# EAGLE design 7segement4digits1badidea-feathershield-ht16k33-mk-1.0 (EAGLE 7.5.0)
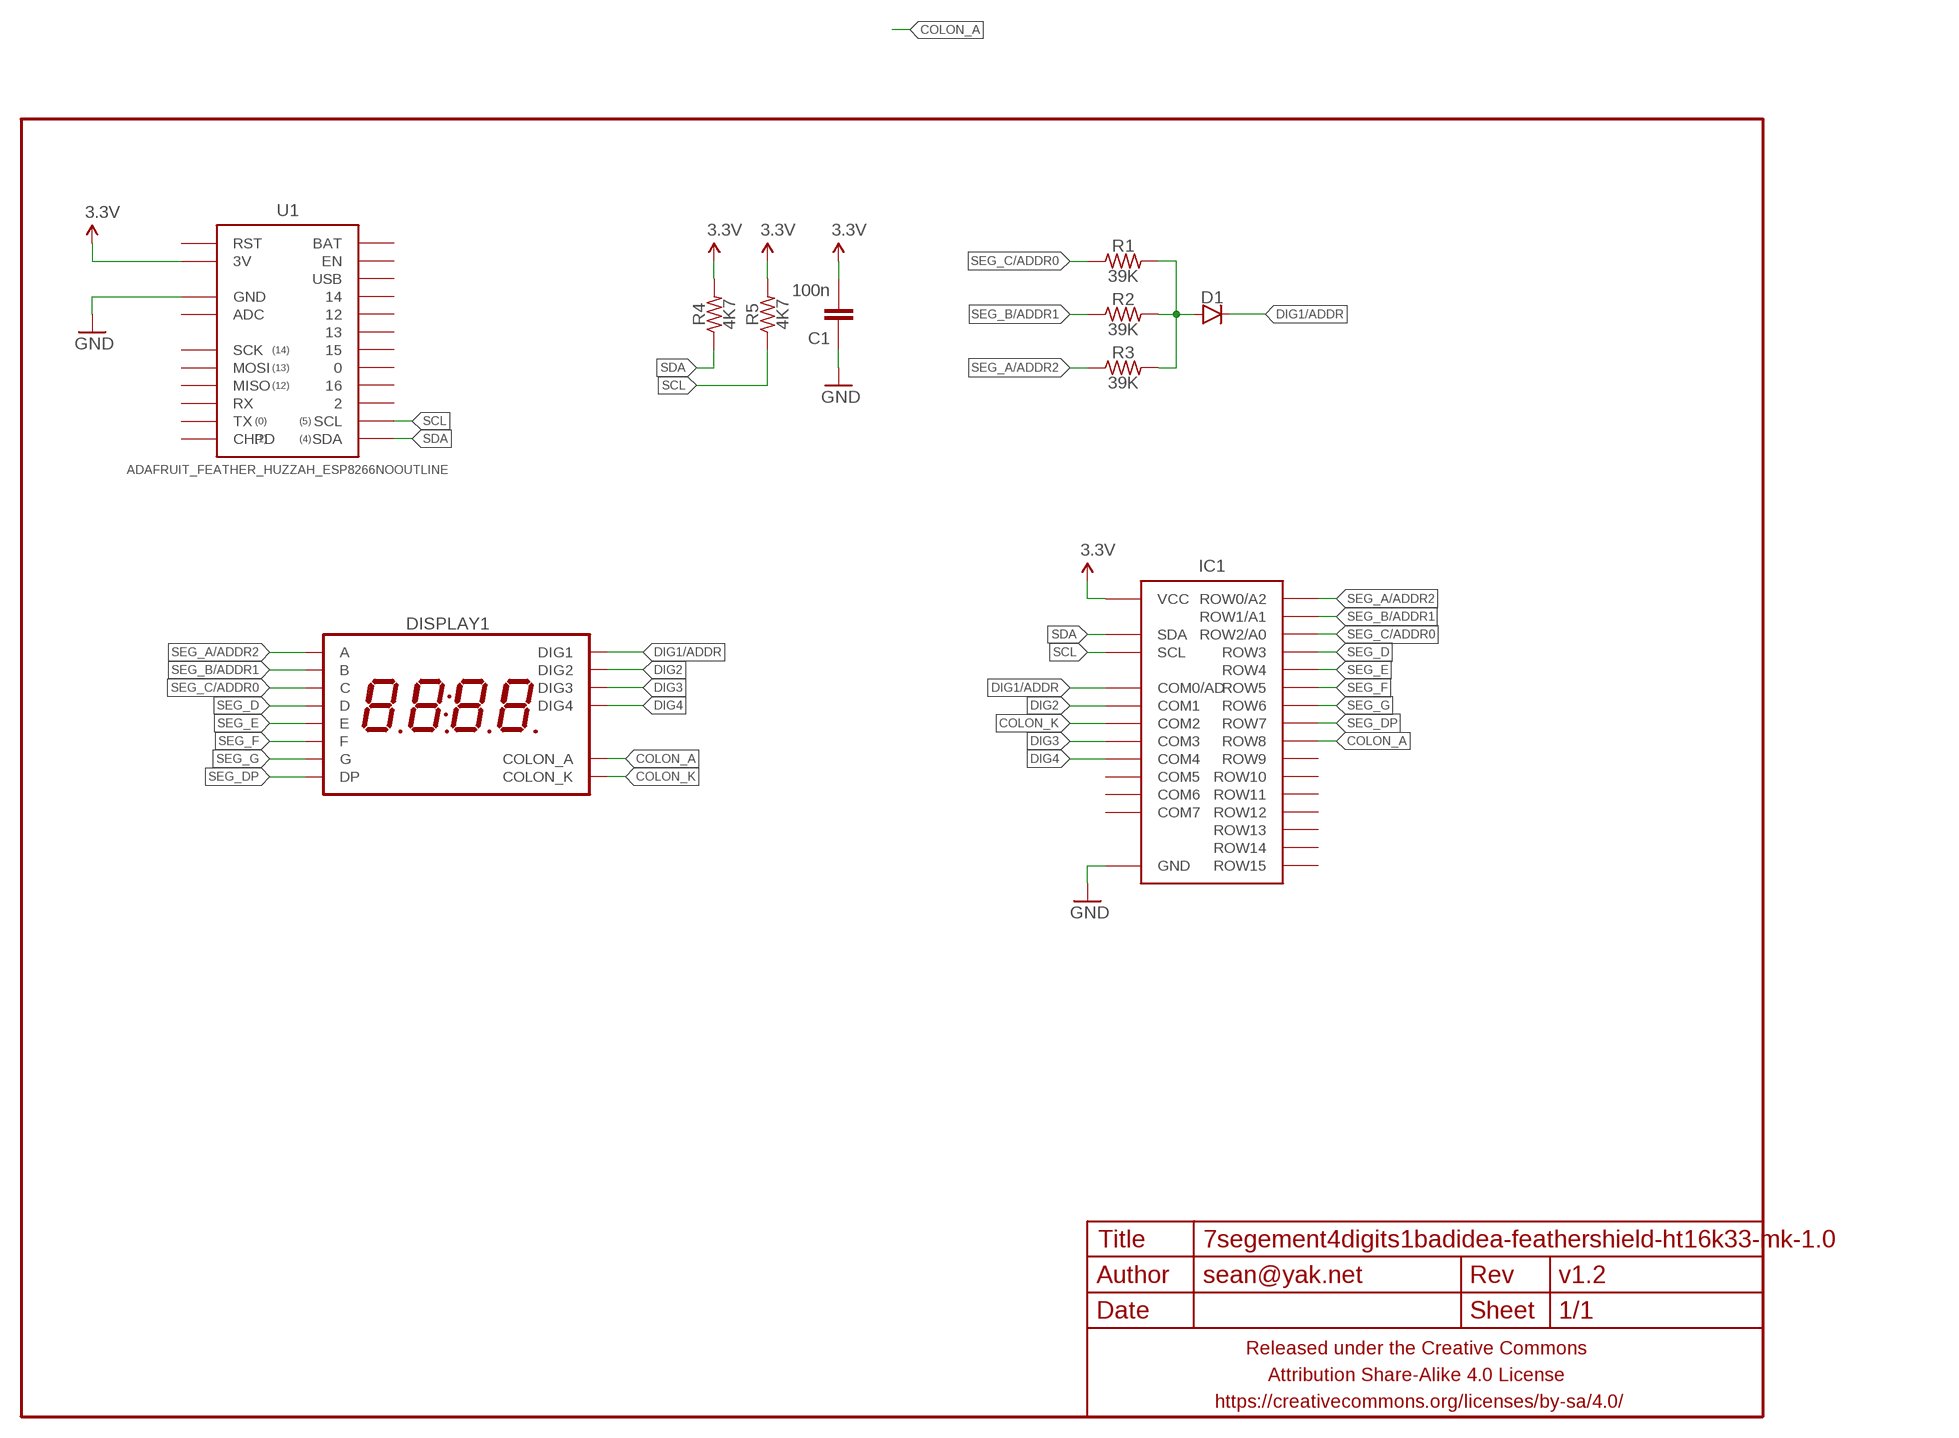
[diagram p0: schematic, sheet 1]

## Parts
C1  100n  CAPACITOR-CERAMICC0603  [C0603]
D1  DIODESOD123  [SOD123]
DISPLAY1  7SEG_4DIGIT_COLON14.2MM-CC  [7SEG_4DIG_0.56IN_14MM_ADAFRUIT]
FRAME1  FRAME-LETTERNO_PACKAGE  [DUMMY]
IC1  HT16K33  HT16K33-28SOIC28W  [SOIC28W]
R1  39K  RESISTORR0603  [R0603]
R2  39K  RESISTORR0603  [R0603]
R3  39K  RESISTORR0603  [R0603]
R4  4K7  RESISTORR0603  [R0603]
R5  4K7  RESISTORR0603  [R0603]
U1  ADAFRUIT_FEATHER_HUZZAH_ESP8266NOOUTLINE  [ADAFRUIT_FEATHER_HUZZAH_NOOUTLINE]

## Nets
3.3V: C1.2 IC1.28(VCC) R4.2 R5.2 U1.3V
COLON_A: DISPLAY1.P$8(COLON_A) IC1.17(ROW8)
COLON_K: DISPLAY1.P$7(COLON_K) IC1.4(COM2)
DIG1/ADDR: D1.C DISPLAY1.P$14(DIG1) IC1.2(COM0/AD)
DIG2: DISPLAY1.P$11(DIG2) IC1.3(COM1)
DIG3: DISPLAY1.P$10(DIG3) IC1.5(COM3)
DIG4: DISPLAY1.P$6(DIG4) IC1.6(COM4)
GND: C1.1 IC1.1(GND) U1.GND@0(GND)
N$1: D1.A R1.2 R2.2 R3.2
SCL: IC1.26(SCL) R5.1 U1.SCL
SDA: IC1.27(SDA) R4.1 U1.SDA
SEG_A/ADDR2: DISPLAY1.P$13(A) IC1.25(ROW0/A2) R3.1
SEG_B/ADDR1: DISPLAY1.P$9(B) IC1.24(ROW1/A1) R2.1
SEG_C/ADDR0: DISPLAY1.P$4(C) IC1.23(ROW2/A0) R1.1
SEG_D: DISPLAY1.P$2(D) IC1.22(ROW3)
SEG_DP: DISPLAY1.P$3(DP) IC1.18(ROW7)
SEG_E: DISPLAY1.P$1(E) IC1.21(ROW4)
SEG_F: DISPLAY1.P$12(F) IC1.20(ROW5)
SEG_G: DISPLAY1.P$5(G) IC1.19(ROW6)
Unconnected: IC1.7(COM5) IC1.8(COM6) IC1.9(COM7) IC1.10(ROW15) IC1.11(ROW14) IC1.12(ROW13) IC1.13(ROW12) IC1.14(ROW11) IC1.15(ROW10) IC1.16(ROW9) U1.0 U1.2 U1.12 U1.13 U1.14 U1.15 U1.16 U1.ADC U1.BAT U1.CHPD U1.EN U1.MISO U1.MOSI U1.RST U1.RX U1.SCK U1.TX U1.USB

## Library data of the parts
C1 = A_butts:CAPACITOR-CERAMIC: CAPACITOR, European symbol
D1 = a_parts:DIODE: Diode These are standard reverse protection diodes and small signal diodes. SMA package can handle up to about 1A. SOD-323 can handle about 200mA. What the SOD-323 package when ordering, there are some mfgs out there that are 5-pin packages.
DISPLAY1 = a_parts:7SEG_4DIGIT_COLON
FRAME1 = A_butts:FRAME-LETTER: Schematic Frame Standard 8.5x11 US Letter frame; DESIGNER: sean@yak.net; VERSION: v1.2
IC1 = a_parts:HT16K33-28
R1-R5 = a_parts:RESISTOR: RESISTOR, American symbol
U1 = a_parts:ADAFRUIT_FEATHER_HUZZAH_ESP8266

## Board
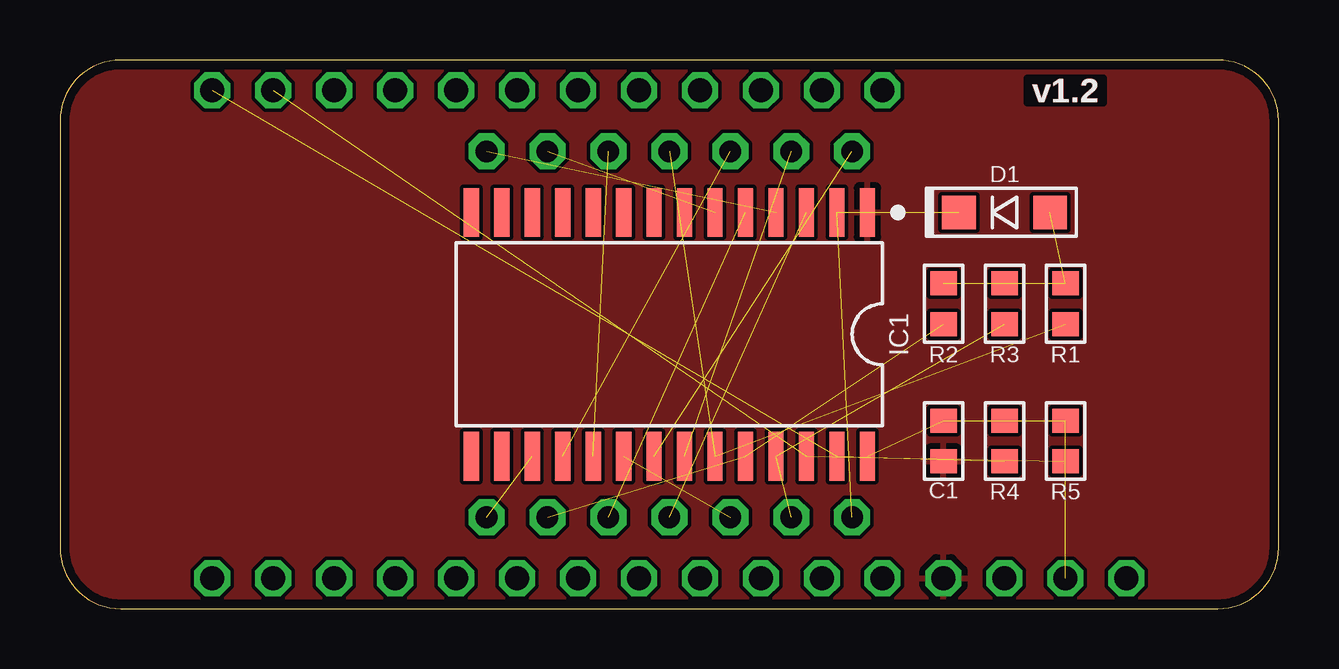
[diagram p1: board, top side]
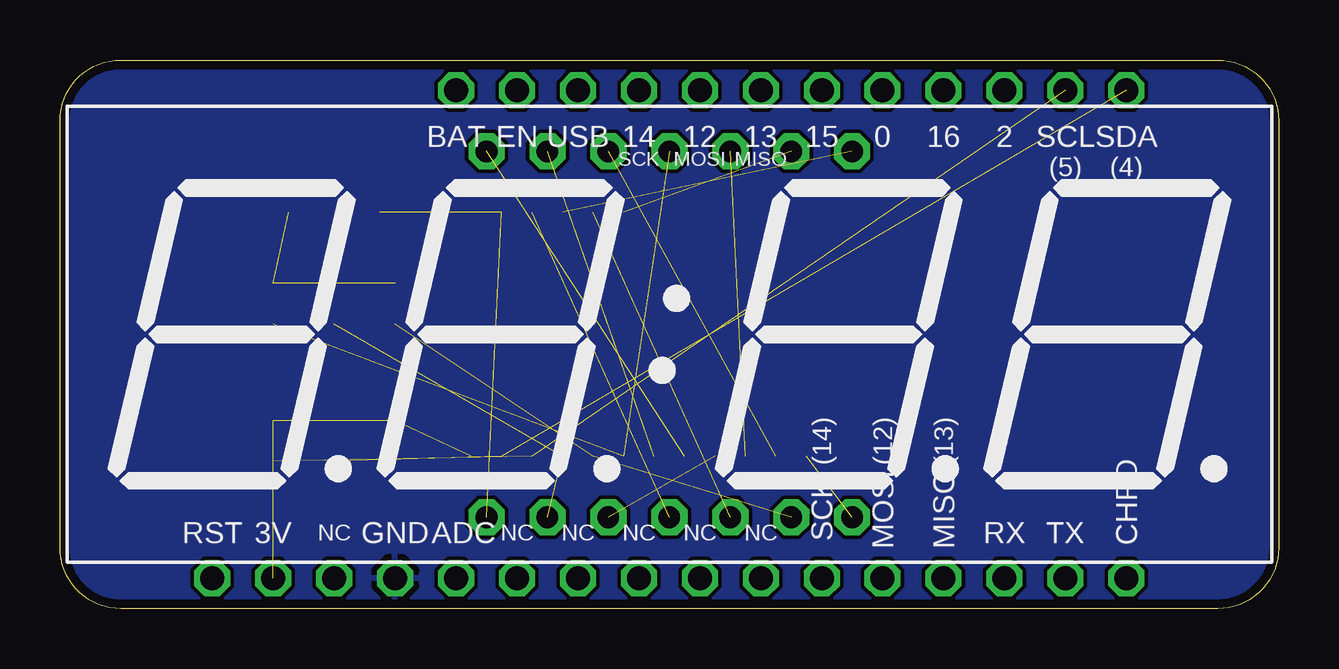
[diagram p2: board, bottom side, seen from below]

Size 50.8 x 22.86 mm. Coordinates in mm from the lower left corner, seen from the top.
Outline: 0,20.32 0,2.54 arc90 2.54,0 48.26,0 arc90 50.8,2.54 50.8,20.32 arc90 48.26,22.86 2.54,22.86 arc90 0,20.32
Copper layers (1*16): Top 0.0356mm / dielectric 1.5011mm / Bottom 0.0356mm
Design rules "LaenPCBOrder_2": minimum track width 6mil, minimum drill 13mil, track to track 6mil, track to pad 6mil, pad to pad 6mil, via to via 6mil, smd to smd 6mil, copper to edge 15mil, drill to drill 6mil, minimum pad ring 7mil, minimum via ring 7mil, stop-mask expansion 3mil, vias tented up to drill 20mil, thermal gap 10mil

### Footprints (pad centres in the part's own frame; a part is rotated, then mirrored left to right if it is on the bottom)
C0603 = smd 1 x 1.1: 1 -0.85,0; 2 0.85,0
SOD123 = smd 1.4 x 1.4: A 1.9,0; C -1.9,0
7SEG_4DIG_0.56IN_14MM_ADAFRUIT = drill 0.9 pad 1.5 octagon: P$1 -7.62,7.62; P$2 -5.08,7.62; P$3 -2.54,7.62; P$4 0,7.62; P$5 2.54,7.62; P$6 5.08,7.62; P$7 7.62,7.62; P$8 7.62,-7.62; P$9 5.08,-7.62; P$10 2.54,-7.62; P$11 0,-7.62; P$12 -2.54,-7.62; P$13 -5.08,-7.62; P$14 -7.62,-7.62
SOIC28W = smd 0.635 x 2.032: 1 -8.255,-5.08; 2 -6.985,-5.08; 3 -5.715,-5.08; 4 -4.445,-5.08; 5 -3.175,-5.08; 6 -1.905,-5.08; 7 -0.635,-5.08; 8 0.635,-5.08; 9 1.905,-5.08; 10 3.175,-5.08; 11 4.445,-5.08; 12 5.715,-5.08; 13 6.985,-5.08; 14 8.255,-5.08; 15 8.255,5.08; 16 6.985,5.08; 17 5.715,5.08; 18 4.445,5.08; 19 3.175,5.08; 20 1.905,5.08; 21 0.635,5.08; 22 -0.635,5.08; 23 -1.905,5.08; 24 -3.175,5.08; 25 -4.445,5.08; 26 -5.715,5.08; 27 -6.985,5.08; 28 -8.255,5.08
R0603 = smd 1 x 1.1: 1 -0.85,0; 2 0.85,0
ADAFRUIT_FEATHER_HUZZAH_NOOUTLINE = drill 1 pad 1.5 octagon: 0 8.89,10.16; 2 13.97,10.16; 3V -16.51,-10.16; 12 1.27,10.16; 13 3.81,10.16; 14 -1.27,10.16; 15 6.35,10.16; 16 11.43,10.16; ADC -8.89,-10.16; BAT -8.89,10.16; CHPD 19.05,-10.16; EN -6.35,10.16; GND@0 -11.43,-10.16; MISO 11.43,-10.16; MOSI 8.89,-10.16; NC@3 -13.97,-10.16; NC@6 -6.35,-10.16; NC@7 -3.81,-10.16; NC@8 -1.27,-10.16; NC@9 1.27,-10.16; NC@10 3.81,-10.16; RST -19.05,-10.16; RX 13.97,-10.16; SCK 6.35,-10.16; SCL 16.51,10.16; SDA 19.05,10.16; TX 16.51,-10.16; USB -3.81,10.16

### Placement (x,y rotation side)
C1  36.83,6.99 90 top
D1  39.37,16.51 0 top
DISPLAY1  25.4,11.43 0 bottom
FRAME1  0,-0.5 0 top
IC1  25.4,11.43 180 top
R1  41.91,12.7 90 top
R2  36.83,12.7 90 top
R3  39.37,12.7 90 top
R4  39.37,6.99 90 top
R5  41.91,6.99 90 top
U1  25.4,11.43 0 bottom

### Tracks (layer width: path | path; a pad name or v marks a point on that pad's centre or on a via)
3.3V  (4 unrouted)
COLON_A  (1 unrouted)
COLON_K  (1 unrouted)
DIG1/ADDR  (2 unrouted)
DIG2  (1 unrouted)
DIG3  (1 unrouted)
DIG4  (1 unrouted)
GND
  pour Top: 48.26,0 2.54,0 arc-90 0,2.54 0,20.32 arc-90 2.54,22.86 48.26,22.86 arc-90 50.8,20.32 50.8,2.54 arc-90
  pour Bottom: 50.8,20.32 50.8,2.54 arc-90 48.26,0 2.54,0 arc-90 0,2.54 0,20.32 arc-90 2.54,22.86 48.26,22.86 arc-90
N$1  (3 unrouted)
SCL  (2 unrouted)
SDA  (2 unrouted)
SEG_A/ADDR2  (2 unrouted)
SEG_B/ADDR1  (2 unrouted)
SEG_C/ADDR0  (2 unrouted)
SEG_D  (1 unrouted)
SEG_DP  (1 unrouted)
SEG_E  (1 unrouted)
SEG_F  (1 unrouted)
SEG_G  (1 unrouted)